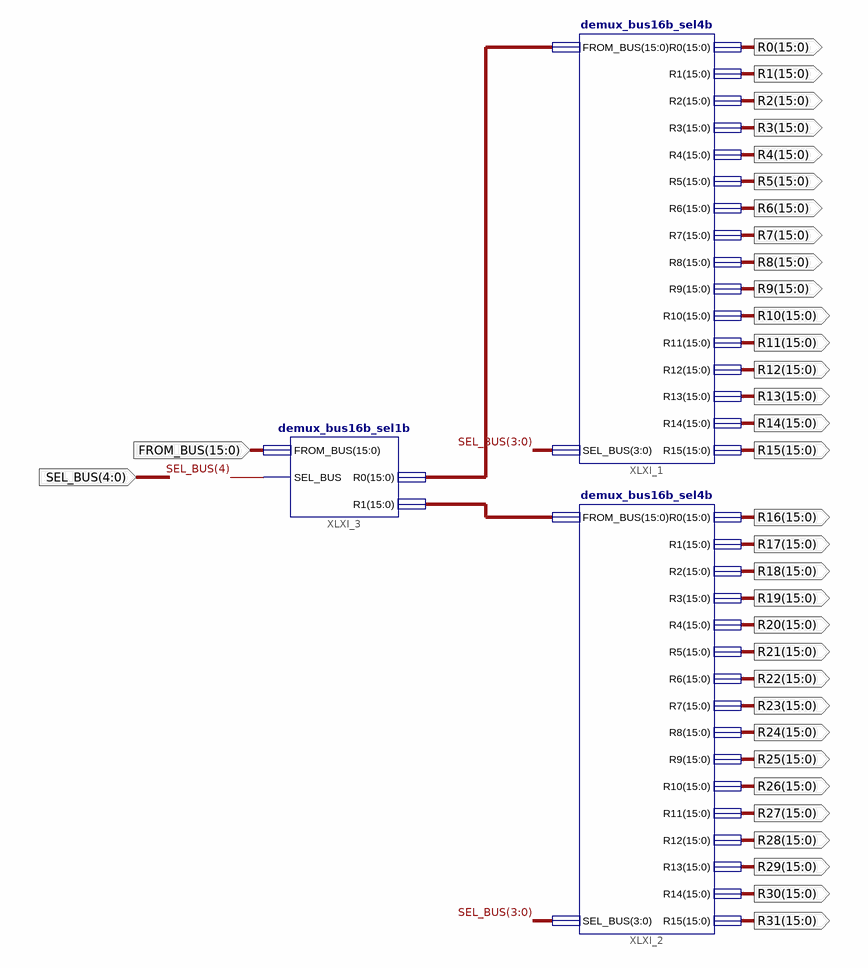
[diagram p0: schematic sheet 1]
// Xilinx ISE schematic demux_bus16b_sel5b.sch (artix7) as structural Verilog: 3 symbols, 34 ports
module demux_bus16b_sel5b (
  input  [4:0] SEL_BUS,
  input  [15:0] FROM_BUS,
  output [15:0] R0,
  output [15:0] R1,
  output [15:0] R2,
  output [15:0] R3,
  output [15:0] R4,
  output [15:0] R5,
  output [15:0] R6,
  output [15:0] R7,
  output [15:0] R8,
  output [15:0] R9,
  output [15:0] R10,
  output [15:0] R11,
  output [15:0] R12,
  output [15:0] R13,
  output [15:0] R14,
  output [15:0] R15,
  output [15:0] R16,
  output [15:0] R17,
  output [15:0] R18,
  output [15:0] R19,
  output [15:0] R20,
  output [15:0] R21,
  output [15:0] R22,
  output [15:0] R23,
  output [15:0] R24,
  output [15:0] R25,
  output [15:0] R26,
  output [15:0] R27,
  output [15:0] R28,
  output [15:0] R29,
  output [15:0] R30,
  output [15:0] R31
);

  wire [15:0] XLXN_1, XLXN_2;

  demux_bus16b_sel4b XLXI_1 (
    .FROM_BUS(XLXN_1), .SEL_BUS(SEL_BUS[3:0]), .R0(R0), .R1(R1), .R2(R2), .R3(R3), .R4(R4), .R5(R5), .R6(R6),
    .R7(R7), .R8(R8), .R9(R9), .R10(R10), .R11(R11), .R12(R12), .R13(R13), .R14(R14), .R15(R15));
  demux_bus16b_sel4b XLXI_2 (
    .FROM_BUS(XLXN_2), .SEL_BUS(SEL_BUS[3:0]), .R0(R16), .R1(R17), .R2(R18), .R3(R19), .R4(R20), .R5(R21),
    .R6(R22), .R7(R23), .R8(R24), .R9(R25), .R10(R26), .R11(R27), .R12(R28), .R13(R29), .R14(R30), .R15(R31));
  demux_bus16b_sel1b XLXI_3 (.SEL_BUS(SEL_BUS[4]), .FROM_BUS(FROM_BUS), .R0(XLXN_1), .R1(XLXN_2));
endmodule
